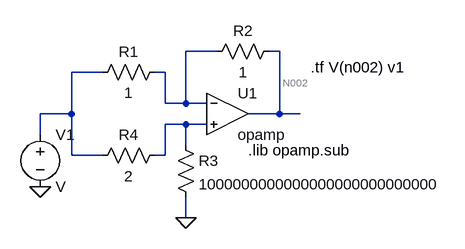
[diagram p0: schematic pag7es4p1.asc]
pag7es4p1.asc, the LTspice schematic file:
Version 4
SHEET 1 880 680
WIRE 224 64 176 64
WIRE 320 64 304 64
WIRE 48 96 0 96
WIRE 144 96 128 96
WIRE 144 144 144 96
WIRE 176 144 176 64
WIRE 176 144 144 144
WIRE 208 144 176 144
WIRE 0 160 0 96
WIRE 0 160 -48 160
WIRE 320 160 320 64
WIRE 320 160 272 160
WIRE 352 160 320 160
WIRE 176 176 144 176
WIRE 208 176 176 176
WIRE -48 192 -48 160
WIRE 176 208 176 176
WIRE 0 224 0 160
WIRE 48 224 0 224
WIRE 144 224 144 176
WIRE 144 224 128 224
WIRE 176 320 176 288
FLAG 176 320 0
FLAG -48 272 0
SYMBOL OpAmps\\opamp 240 96 R0
SYMATTR InstName U1
SYMBOL res 320 48 R90
WINDOW 0 0 56 VBottom 2
WINDOW 3 32 56 VTop 2
SYMATTR InstName R2
SYMATTR Value 1
SYMBOL res 160 192 R0
SYMATTR InstName R3
SYMATTR Value 1000000000000000000000000000
SYMBOL res 144 80 R90
WINDOW 0 0 56 VBottom 2
WINDOW 3 32 56 VTop 2
SYMATTR InstName R1
SYMATTR Value 1
SYMBOL res 144 208 R90
WINDOW 0 0 56 VBottom 2
WINDOW 3 32 56 VTop 2
SYMATTR InstName R4
SYMATTR Value 2
SYMBOL voltage -48 176 R0
SYMATTR InstName V1
TEXT 272 216 Left 2 !.lib opamp.sub
TEXT 368 88 Left 2 !.tf V(n002) v1

The netlist it stands for:
* pag7es4p1.asc
XU1 N001 N004 N002 opamp Aol=100K GBW=10Meg  ; pins invin noninvin out
R2 N002 N001 1
R3 N004 0 1000000000000000000000000000
R1 N001 N003 1
R4 N004 N003 2
V1 N003 0 V
.lib opamp.sub
.tf V(n002) v1
.backanno
.end